# Altium schematic sheet УШЯИ.411522.033Э3_1.SCHDOC
size 420 x 297 mm; SheetNumber: 1; SheetTotal: 5; DocumentName: Sheet1.SCHDOC
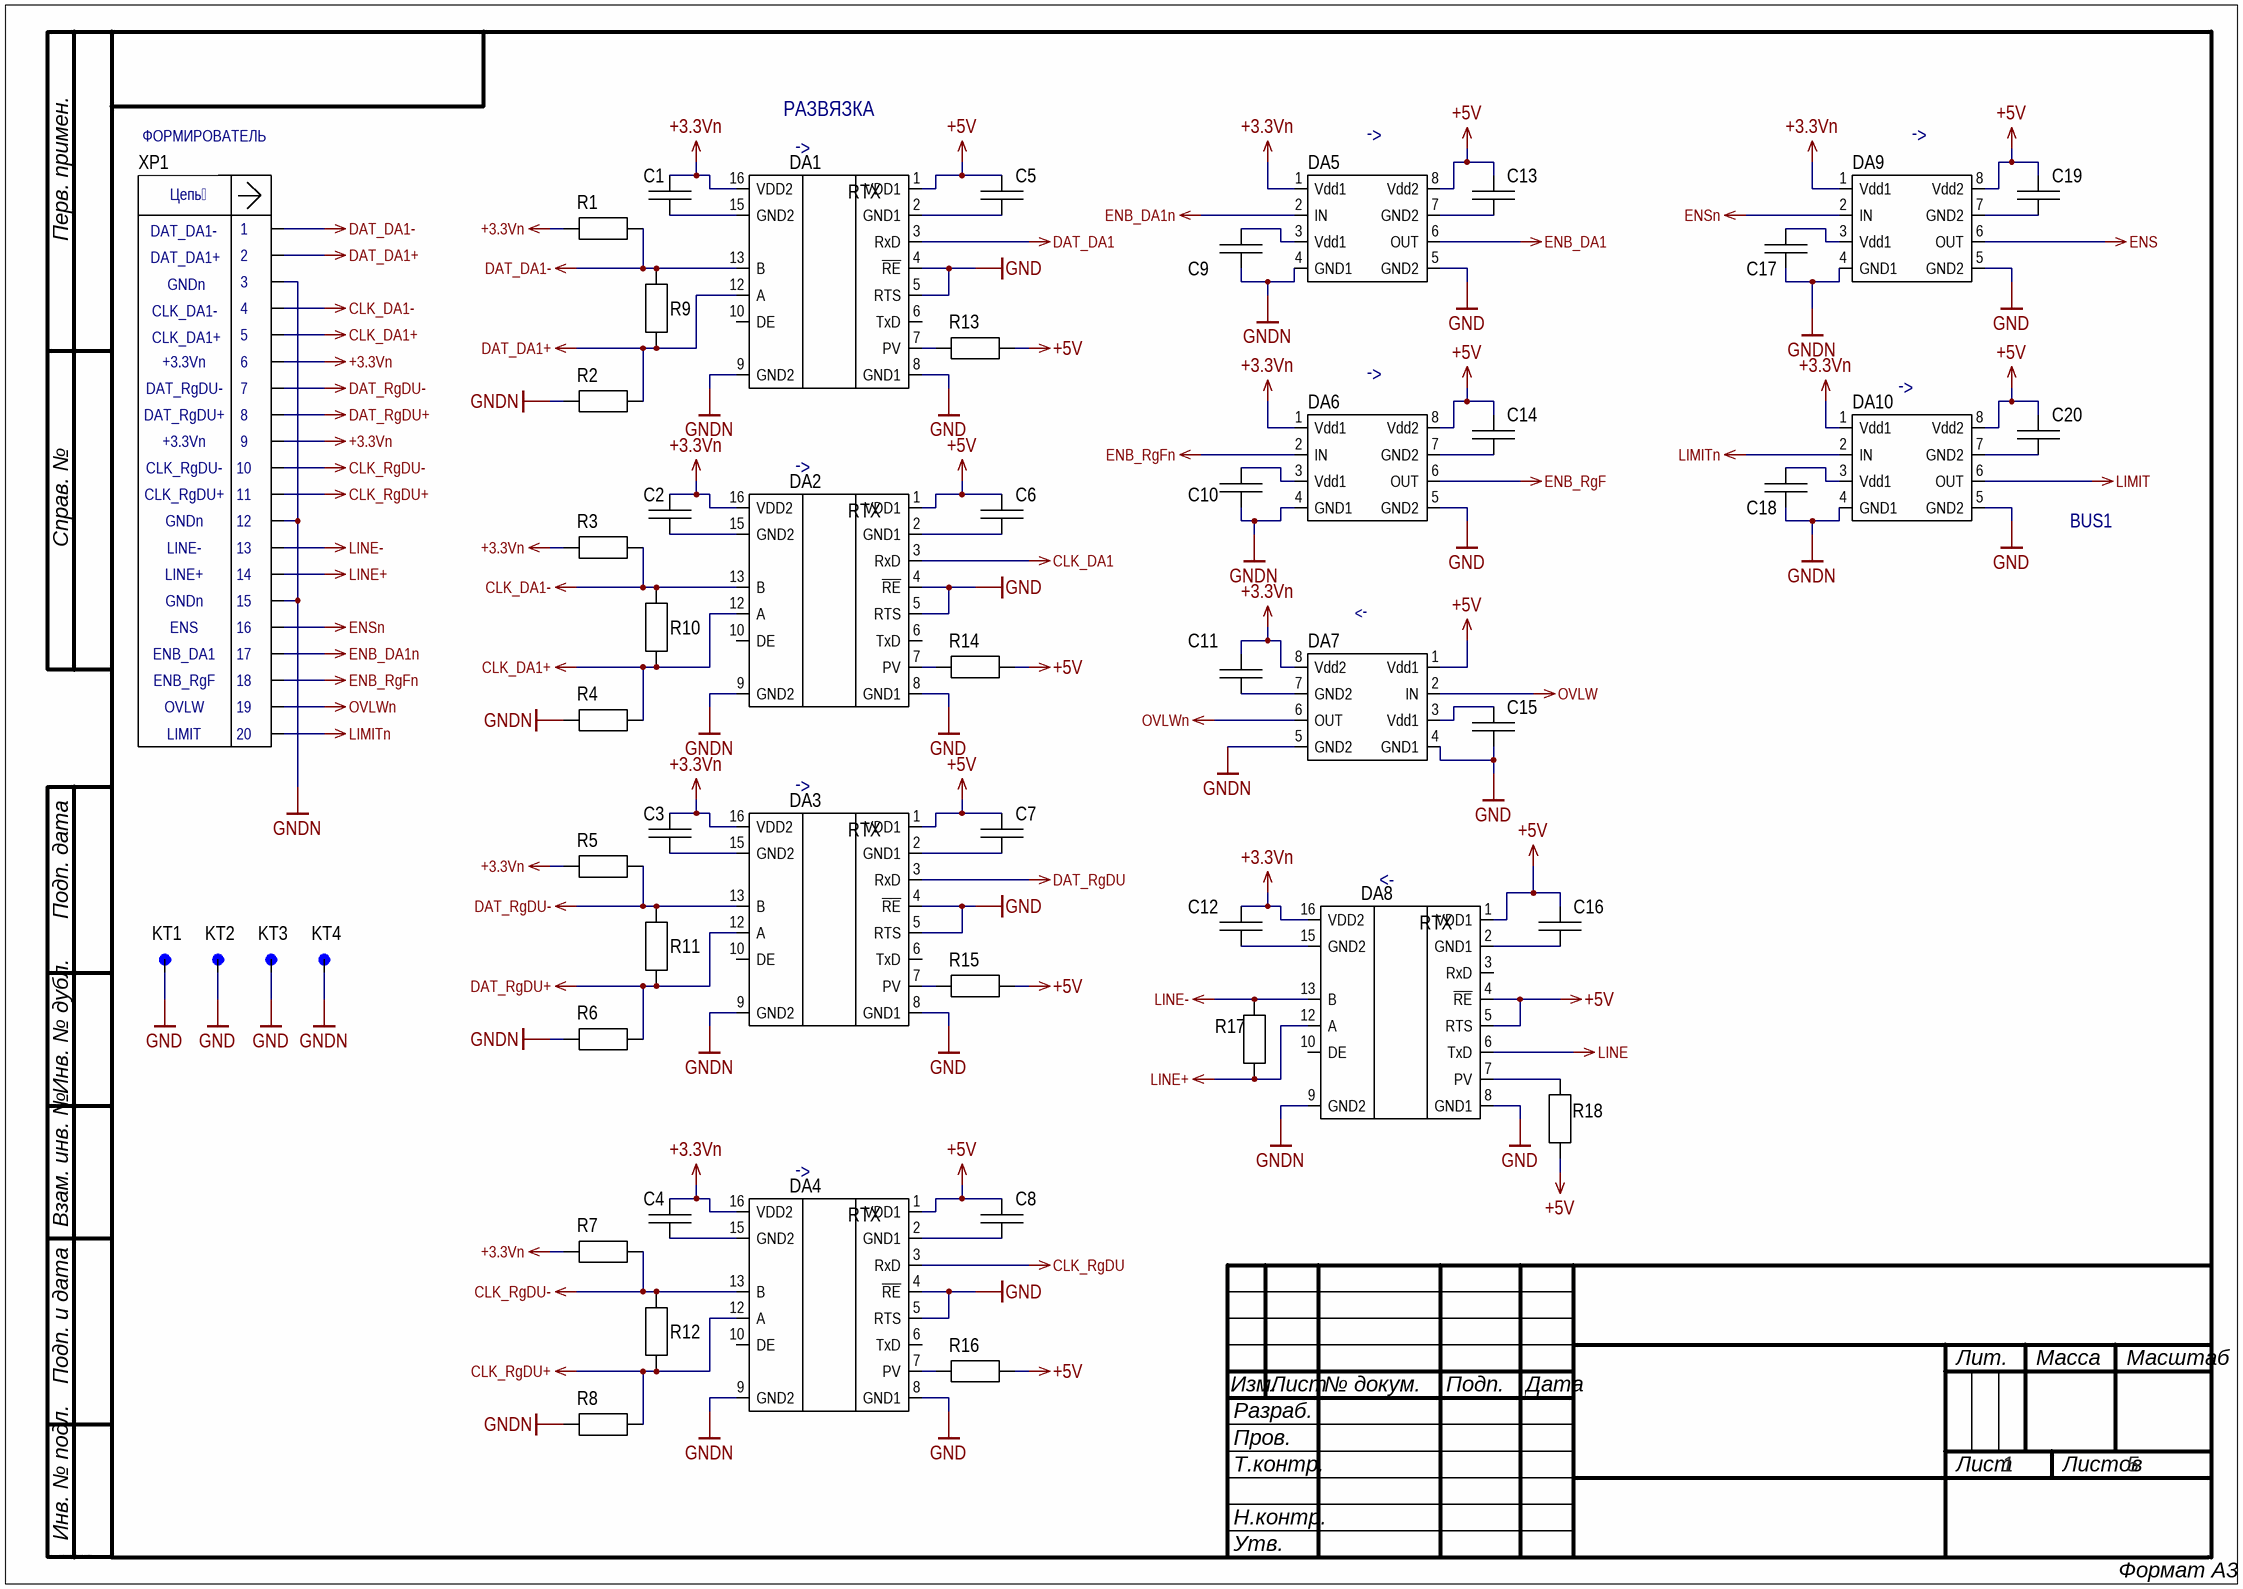
[diagram p0: УШЯИ.411522.033Э3_1.SCHDOC]

## Parts
C1  0805-X7R-25 В-0,1 мкФ +-10%  [CAP: 0805]  (value not drawn)
C2  0805-X7R-25 В-0,1 мкФ +-10%  [CAP: 0805]  (value not drawn)
C3  0805-X7R-25 В-0,1 мкФ +-10%  [CAP: 0805]  (value not drawn)
C4  0805-X7R-25 В-0,1 мкФ +-10%  [CAP: 0805]  (value not drawn)
C5  0805-X7R-25 В-0,1 мкФ +-10%  [CAP: 0805]  (value not drawn)
C6  0805-X7R-25 В-0,1 мкФ +-10%  [CAP: 0805]  (value not drawn)
C7  0805-X7R-25 В-0,1 мкФ +-10%  [CAP: 0805]  (value not drawn)
C8  0805-X7R-25 В-0,1 мкФ +-10%  [CAP: 0805]  (value not drawn)
C9  0805-X7R-25 В-0,1 мкФ +-10%  [CAP: 0805]  (value not drawn)
C10  0805-X7R-25 В-0,1 мкФ +-10%  [CAP: 0805]  (value not drawn)
C11  0805-X7R-25 В-0,1 мкФ +-10%  [CAP: 0805]  (value not drawn)
C12  0805-X7R-25 В-0,1 мкФ +-10%  [CAP: 0805]  (value not drawn)
C13  0805-X7R-25 В-0,1 мкФ +-10%  [CAP: 0805]  (value not drawn)
C14  0805-X7R-25 В-0,1 мкФ +-10%  [CAP: 0805]  (value not drawn)
C15  0805-X7R-25 В-0,1 мкФ +-10%  [CAP: 0805]  (value not drawn)
C16  0805-X7R-25 В-0,1 мкФ +-10%  [CAP: 0805]  (value not drawn)
C17  0805-X7R-25 В-0,1 мкФ +-10%  [CAP: 0805]  (value not drawn)
C18  0805-X7R-25 В-0,1 мкФ +-10%  [CAP: 0805]  (value not drawn)
C19  0805-X7R-25 В-0,1 мкФ +-10%  [CAP: 0805]  (value not drawn)
C20  0805-X7R-25 В-0,1 мкФ +-10%  [CAP: 0805]  (value not drawn)
DA1  ADM2486BRWZ  [16-SOIC-W]  (value not drawn)
DA2  ADM2486BRWZ  [16-SOIC-W]  (value not drawn)
DA3  ADM2486BRWZ  [16-SOIC-W]  (value not drawn)
DA4  ADM2486BRWZ  [16-SOIC-W]  (value not drawn)
DA5  ADuM1100AR  [8-SOIC]  (value not drawn)
DA6  ADuM1100AR  [8-SOIC]  (value not drawn)
DA7  ADuM1100AR  [8-SOIC]  (value not drawn)
DA8  ADM2486BRWZ  [16-SOIC-W]  (value not drawn)
DA9  ADuM1100AR  [8-SOIC]  (value not drawn)
DA10  ADuM1100AR  [8-SOIC]  (value not drawn)
KT1  Lepestok  [LEPESTOK7_750_224]  (value not drawn)
KT2  Lepestok  [LEPESTOK7_750_224]  (value not drawn)
KT3  Lepestok  [LEPESTOK7_750_224]  (value not drawn)
KT4  Lepestok  [LEPESTOK7_750_224]  (value not drawn)
R1  1206-1 кОм+-5%  [1206]  (value not drawn)
R2  1206-1 кОм+-5%  [1206]  (value not drawn)
R3  1206-1 кОм+-5%  [1206]  (value not drawn)
R4  1206-1 кОм+-5%  [1206]  (value not drawn)
R5  1206-1 кОм+-5%  [1206]  (value not drawn)
R6  1206-1 кОм+-5%  [1206]  (value not drawn)
R7  1206-1 кОм+-5%  [1206]  (value not drawn)
R8  1206-1 кОм+-5%  [1206]  (value not drawn)
R9  1206-100 Ом+-5%  [1206]  (value not drawn)
R10  1206-100 Ом+-5%  [1206]  (value not drawn)
R11  1206-100 Ом+-5%  [1206]  (value not drawn)
R12  1206-100 Ом+-5%  [1206]  (value not drawn)
R13  1206-12 кОм+-5%  [1206]  (value not drawn)
R14  1206-12 кОм+-5%  [1206]  (value not drawn)
R15  1206-12 кОм+-5%  [1206]  (value not drawn)
R16  1206-12 кОм+-5%  [1206]  (value not drawn)
R17  1206-100 Ом+-5%  [1206]  (value not drawn)
R18  1206-12 кОм+-5%  [1206]  (value not drawn)
XP1  BH2-20  [DS1014-20S]  (value not drawn)

## Nets
+3.3Vn: C1.2 C2.2 C3.2 C4.2 C11.1 C12.2 DA1.16(VDD2) DA2.16(VDD2) DA3.16(VDD2) DA4.16(VDD2) DA5.1(Vdd1) DA6.1(Vdd1) DA7.8(Vdd2) DA8.16(VDD2) DA9.1(Vdd1) DA10.1(Vdd1) R1.1 R3.1 R5.1 R7.1 XP1.6 XP1.9
+5V: C5.2 C6.2 C7.2 C8.2 C13.1 C14.1 C16.2 C19.1 C20.1 DA1.1(VDD1) DA2.1(VDD1) DA3.1(VDD1) DA4.1(VDD1) DA5.8(Vdd2) DA6.8(Vdd2) DA7.1(Vdd1) DA8.1(VDD1) DA8.4(~{RE}) DA8.5(RTS) DA9.8(Vdd2) DA10.8(Vdd2) R13.1 R14.1 R15.1 R16.1 R18.1
CLK_DA1: DA2.3(RxD)
CLK_DA1+: DA2.12(A) R4.2 R10.1 XP1.5
CLK_DA1-: DA2.13(B) R3.2 R10.2 XP1.4
CLK_RgDU: DA4.3(RxD)
CLK_RgDU+: DA4.12(A) R8.2 R12.1 XP1.11
CLK_RgDU-: DA4.13(B) R7.2 R12.2 XP1.10
DAT_DA1: DA1.3(RxD)
DAT_DA1+: DA1.12(A) R2.2 R9.1 XP1.2
DAT_DA1-: DA1.13(B) R1.2 R9.2 XP1.1
DAT_RgDU: DA3.3(RxD)
DAT_RgDU+: DA3.12(A) R6.2 R11.1 XP1.8
DAT_RgDU-: DA3.13(B) R5.2 R11.2 XP1.7
ENB_DA1: DA5.6(OUT)
ENB_DA1n: DA5.2(IN) XP1.17
ENB_RgF: DA6.6(OUT)
ENB_RgFn: DA6.2(IN) XP1.18
ENS: DA9.6(OUT)
ENSn: DA9.2(IN) XP1.16
GND: C15.1 DA1.4(~{RE}) DA1.5(RTS) DA1.8(GND1) DA2.4(~{RE}) DA2.5(RTS) DA2.8(GND1) DA3.4(~{RE}) DA3.5(RTS) DA3.8(GND1) DA4.4(~{RE}) DA4.5(RTS) DA4.8(GND1) DA5.5(GND2) DA6.5(GND2) DA7.4(GND1) DA8.8(GND1) DA9.5(GND2) DA10.5(GND2) KT1.1 KT2.1 KT3.1
GNDN: C9.1 C10.1 C17.1 C18.1 DA1.9(GND2) DA2.9(GND2) DA3.9(GND2) DA4.9(GND2) DA5.4(GND1) DA6.4(GND1) DA7.5(GND2) DA8.9(GND2) DA9.4(GND1) DA10.4(GND1) KT4.1 R2.1 R4.1 R6.1 R8.1 XP1.3 XP1.12 XP1.15
LIMIT: DA10.6(OUT)
LIMITn: DA10.2(IN) XP1.20
LINE: DA8.6(TxD)
LINE+: DA8.12(A) R17.1 XP1.14
LINE-: DA8.13(B) R17.2 XP1.13
OVLW: DA7.2(IN)
OVLWn: DA7.6(OUT) XP1.19
NetC1_1: C1.1 DA1.15(GND2)
NetC2_1: C2.1 DA2.15(GND2)
NetC3_1: C3.1 DA3.15(GND2)
NetC4_1: C4.1 DA4.15(GND2)
NetC5_1: C5.1 DA1.2(GND1)
NetC6_1: C6.1 DA2.2(GND1)
NetC7_1: C7.1 DA3.2(GND1)
NetC8_1: C8.1 DA4.2(GND1)
NetC9_2: C9.2 DA5.3(Vdd1)
NetC10_2: C10.2 DA6.3(Vdd1)
NetC11_2: C11.2 DA7.7(GND2)
NetC12_1: C12.1 DA8.15(GND2)
NetC13_2: C13.2 DA5.7(GND2)
NetC14_2: C14.2 DA6.7(GND2)
NetC15_2: C15.2 DA7.3(Vdd1)
NetC16_1: C16.1 DA8.2(GND1)
NetC17_2: C17.2 DA9.3(Vdd1)
NetC18_2: C18.2 DA10.3(Vdd1)
NetC19_2: C19.2 DA9.7(GND2)
NetC20_2: C20.2 DA10.7(GND2)
NetDA1_7: DA1.7(PV) R13.2
NetDA2_7: DA2.7(PV) R14.2
NetDA3_7: DA3.7(PV) R15.2
NetDA4_7: DA4.7(PV) R16.2
NetDA8_7: DA8.7(PV) R18.2

Not connected (* = marked no-connect by the designer): DA1 6(TxD) 10(DE); DA2 6(TxD) 10(DE); DA3 6(TxD) 10(DE); DA4 6(TxD) 10(DE); DA8 3(RxD) 10(DE)

## Notes on the sheet
- РАЗВЯЗКА
- ФОРМИРОВАТЕЛЬ
- (near DA1) <-
- (near DA5) <-
- (near DA9) <-
- (near XP1) DAT_DA1-
- (near XP1) 1
- (near XP1) 2
- (near XP1) DAT_DA1+
- (near XP1) CLK_DA1-
- GNDn
- (near XP1) 3
- (near XP1) 4
- (near XP1) 5
- (near XP1) CLK_DA1+
- +3.3Vn
- (near XP1) DAT_RgDU-
- (near XP1) 6
- (near XP1) 7
- (near DA6) <-
- (near DA10) <-
- (near XP1) DAT_RgDU+
- (near XP1) CLK_RgDU-
- (near XP1) 8
- (near XP1) 9
- (near XP1) 10
- (near DA2) <-
- (near XP1) CLK_RgDU+
- (near XP1) 11
- (near XP1) 12
- BUS1
- LINE-
- LINE+
- (near XP1) 13
- (near XP1) 14
- (near XP1) 15
- ENS
- ENB_DA1
- (near XP1) 16
- (near XP1) 17
- (near DA7) ->
- LIMIT
- OVLW
- ENB_RgF
- (near XP1) 18
- (near XP1) 19
- (near XP1) 20
- (near DA3) <-
- (near DA8) <-
- (near DA4) <-
- Перв. примен.
- Справ. №
- Подп. дата
- Инв. № дубл.
- Взам. инв. №
- Подп. и дата
- Изм.
- Разраб.
- Лист
- № докум.
- Подп.
- Дата
- Лит.
- Масса
- Масштаб
- Пров.
- Т.контр.
- Листов
- Инв. № подл.
- Н.контр.
- Утв.
- ALTIUM GOSTBOM2.0 KEV
- Формат А3
- (in symbol ADM2486BRWZ) RTX
- (in symbol BH2-20) Цепь

## Library data of the parts
C1-C20 = 0805-X7R-25 В-0,1 мкФ +-10%: Value: 0,1 мкФ
DA1-DA4 DA8 = ADM2486BRWZ: Isolated RS-485 Transceiver,  20 Mbps data rate, SOIC-16-W
DA5-DA7 DA9 DA10 = ADuM1100AR: iCoupler Digital Isolator
R1-R8 = 1206-1 кОм+-5%: Value: 1 кОм; ModelPrint: 1206
R9-R12 R17 = 1206-100 Ом+-5%: Value: 100 Ом; ModelPrint: 1206
R13-R16 R18 = 1206-12 кОм+-5%: Value: 12 кОм; ModelPrint: 1206
XP1 = BH2-20: pitch 2mm, 20 pin 2x10